# Altium project piezo-driver1.PrjPcb
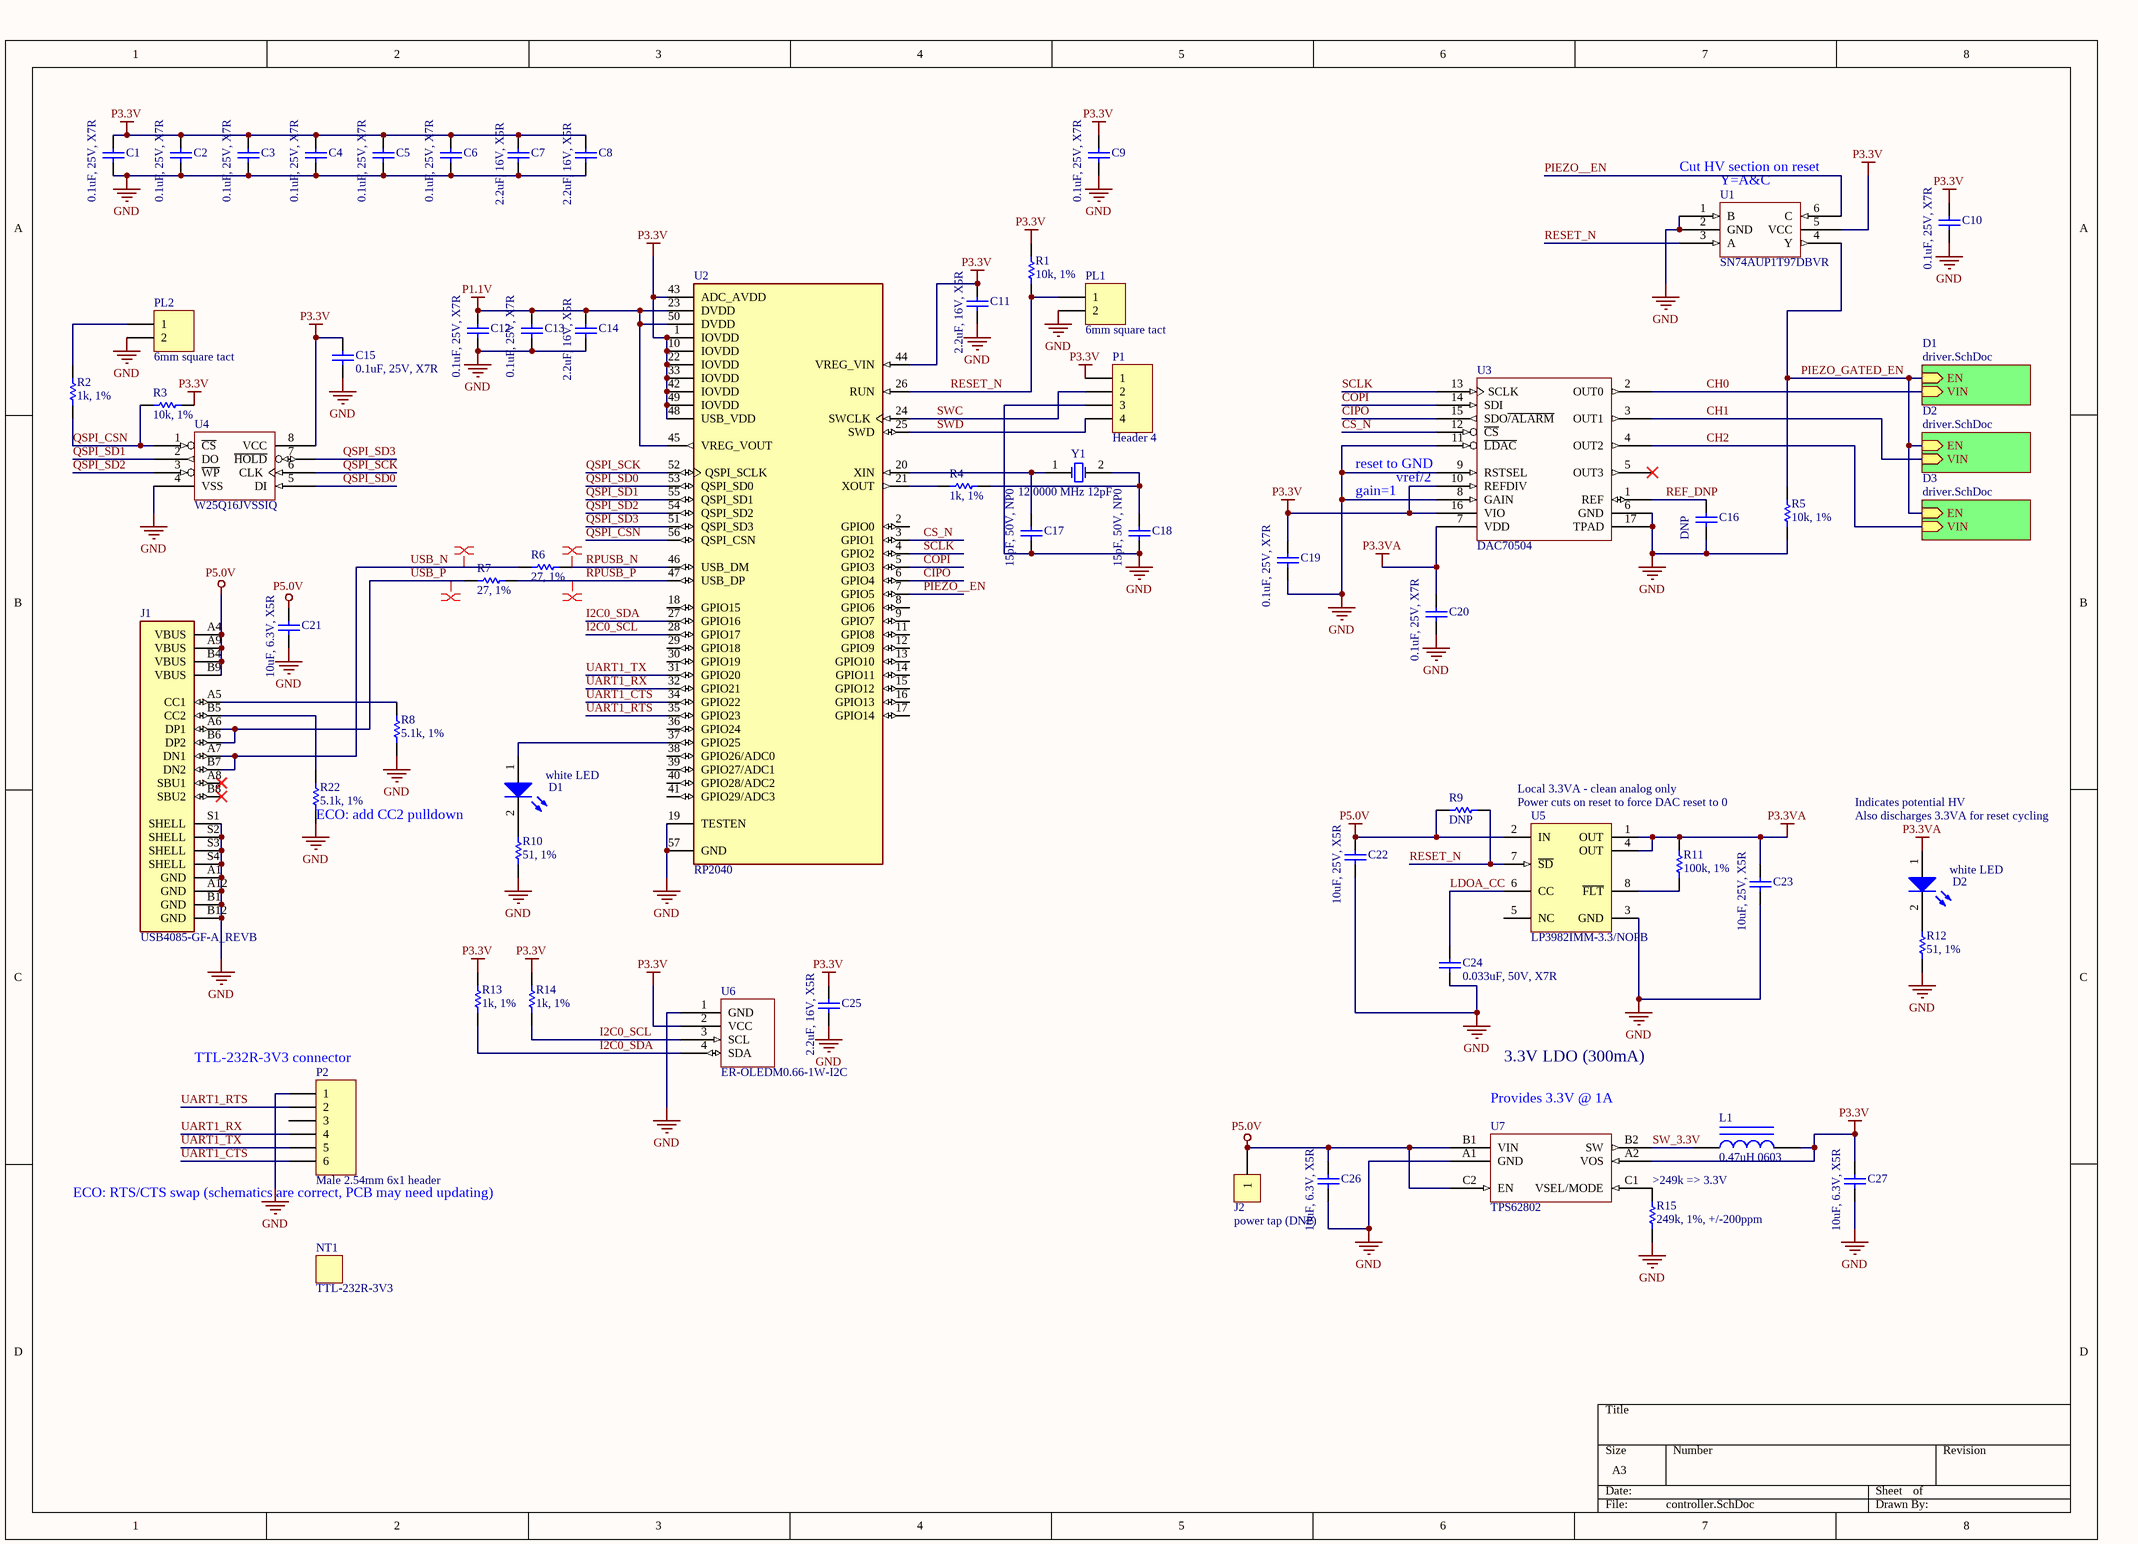
[diagram p0: controller.SchDoc]
2 sheets, 106 parts. Net scope: hierarchical (ports join the sheet entries above them; power ports are global).
Board file: piezo-driver1.PcbDoc
Sheets:
  controller.SchDoc
    D1 = driver.SchDoc
    D2 = driver.SchDoc
    D3 = driver.SchDoc

## Sheet controller.SchDoc
size A3; SheetNumber: 1; SheetTotal: 2

### Parts
C1  0.1uF, 25V, X7R  [B_CAP0603]
C2  0.1uF, 25V, X7R  [B_CAP0603]
C3  0.1uF, 25V, X7R  [B_CAP0603]
C4  0.1uF, 25V, X7R  [B_CAP0603]
C5  0.1uF, 25V, X7R  [B_CAP0603]
C6  0.1uF, 25V, X7R  [B_CAP0603]
C7  2.2uF, 16V, X5R  [B_CAP0603]
C8  2.2uF, 16V, X5R  [B_CAP0603]
C9  0.1uF, 25V, X7R  [B_CAP0603]
C10  0.1uF, 25V, X7R  [B_CAP0603]
C11  2.2uF, 16V, X5R  [B_CAP0603]
C12  0.1uF, 25V, X7R  [B_CAP0603]
C13  0.1uF, 25V, X7R  [B_CAP0603]
C14  2.2uF, 16V, X5R  [B_CAP0603]
C15  0.1uF, 25V, X7R  [B_CAP0603]
C16  DNP  [B_CAP0603]
C17  15pF, 50V, NP0  [B_CAP0603]
C18  15pF, 50V, NP0  [B_CAP0603]
C19  0.1uF, 25V, X7R  [B_CAP0603]
C20  0.1uF, 25V, X7R  [B_CAP0603]
C21  10uF, 6.3V, X5R  [B_CAP0603]
C22  10uF, 25V, X5R  [B_CAP0805]
C23  10uF, 25V, X5R  [B_CAP0805]
C24  0.033uF, 50V, X7R  [B_CAP0603]
C25  2.2uF, 16V, X5R  [B_CAP0603]
C26  10uF, 6.3V, X5R  [B_CAP0603]
C27  10uF, 6.3V, X5R  [B_CAP0603]
D1  white LED  [B_LED0805]
D2  white LED  [B_LED0805]
J1  USB4085-GF-A_REVB  [GCT_USB4085-GF-A_REVB]
J2  power tap (DNP)  [RESTAP-0603]
L1  0.47uH 0603  [B_IND0603]
NT1  TTL-232R-3V3
P1  Header 4  [HDR1X4]
P2  Male 2.54mm 6x1 header  [HDR1X6]
PL1  6mm square tact  [PANASONIC_EVPAS]
PL2  6mm square tact  [PANASONIC_EVPAS]
R1  10k, 1%  [B_RES0603]
R2  1k, 1%  [B_RES0603]
R3  10k, 1%  [B_RES0603]
R4  1k, 1%  [B_RES0603]
R5  10k, 1%  [B_RES0603]
R6  27, 1%  [B_RES0603]
R7  27, 1%  [B_RES0603]
R8  5.1k, 1%  [B_RES0603]
R9  DNP  [B_RES0603]
R10  51, 1%  [B_RES0603]
R11  100k, 1%  [B_RES0603]
R12  51, 1%  [B_RES0603]
R13  1k, 1%  [B_RES0603]
R14  1k, 1%  [B_RES0603]
R15  249k, 1%, +/-200ppm  [B_RES0402]
R22  5.1k, 1%  [B_RES0603]
U1  SN74AUP1T97DBVR  [SOT26A-6N]
U2  RP2040  [QFN40P700X700X90-57N]
U3  DAC70504  [QFN50P300X300X80_HS-17N]
U4  W25Q16JVSSIQ  [SOIC127P790X216-8N]
U5  LP3982IMM-3.3/NOPB  [MUA08A_N]
U6  ER-OLEDM0.66-1W-I2C  [ER-OLEDM0.66-1W-I2C]
U7  TPS62802  [BGA6C35P2X3_70X105X40_NSMD]
Y1  12.0000 MHz 12pF  [NDK_NX5032A]

### Sub-sheets
D1 = driver.SchDoc: EN (in), VIN (in)
D2 = driver.SchDoc: EN (in), VIN (in)
D3 = driver.SchDoc: EN (in), VIN (in)

### Nets
GND: C1.2 C2.2 C3.2 C4.2 C5.2 C6.2 C7.2 C8.2 C9.2 C10.2 C11.2 C12.2 C13.2 C14.2 C15.1 C16.2 C17.1 C18.1 C19.2 C20.2 C21.2 C22.2 C23.2 C24.1 C25.2 C26.2 C27.2 J1.A1(GND) J1.A12(GND) J1.B1(GND) J1.B12(GND) J1.S1(SHELL) J1.S2(SHELL) J1.S3(SHELL) J1.S4(SHELL) P1.3 P2.1 PL1.2 PL2.2 R5.2 R8.1 R10.1 R12.1 R15.2 R22.1 U1.1(B) U1.2(GND) U2.19(TESTEN) U2.57(GND) U3.6(GND) U3.8(GAIN) U3.9(RSTSEL) U3.11(~{LDAC}) U3.17(TPAD) U4.4(VSS) U5.3(GND) U6.1(GND) U7.A1(GND)
P1.1V: C12.1 C13.1 C14.1 U2.23(DVDD) U2.45(VREG_VOUT) U2.50(DVDD)
P3.3V: C1.1 C2.1 C3.1 C4.1 C5.1 C6.1 C7.1 C8.1 C9.1 C10.1 C11.1 C15.2 C19.1 C25.1 C27.1 L1.2 P1.1 R1.1 R3.2 R13.2 R14.2 U1.5(VCC) U2.1(IOVDD) U2.10(IOVDD) U2.22(IOVDD) U2.33(IOVDD) U2.42(IOVDD) U2.43(ADC_AVDD) U2.44(VREG_VIN) U2.48(USB_VDD) U2.49(IOVDD) U3.10(REFDIV) U3.16(VIO) U4.8(VCC) U6.2(VCC) U7.A2(VOS)
P3.3VA: C20.1 C23.1 D2.1(A) R11.2 U3.7(VDD) U5.1(OUT) U5.4(OUT)
P5.0V: C21.1 C22.1 C26.1 J1.A4(VBUS) J1.A9(VBUS) J1.B4(VBUS) J1.B9(VBUS) J2.1 R9.1 U5.2(IN) U7.B1(VIN) U7.C2(EN)
CH0: U3.2(OUT0) ; sheet D1/VIN
CH1: U3.3(OUT1) ; sheet D2/VIN
CH2: U3.4(OUT2) ; sheet D3/VIN
CIPO: U2.6(GPIO4) U3.15(SDO~{/ALARM})
COPI: U2.5(GPIO3) U3.14(SDI)
CS_N: U2.3(GPIO1) U3.12(~{CS})
I2C0_SCL: R14.1 U2.28(GPIO17) U6.3(SCL)
I2C0_SDA: R13.1 U2.27(GPIO16) U6.4(SDA)
LDOA_CC: C24.2 U5.6(CC)
PIEZO__EN: U1.6(C) U2.7(GPIO5)
PIEZO_GATED_EN: R5.1 U1.4(Y) ; sheet D1/EN, sheet D2/EN, sheet D3/EN
QSPI_CSN: R2.1 R3.1 U2.56(QSPI_CSN) U4.1(~{CS})
QSPI_SCK: U2.52(QSPI_SCLK) U4.6(CLK)
QSPI_SD0: U2.53(QSPI_SD0) U4.5(DI)
QSPI_SD1: U2.55(QSPI_SD1) U4.2(DO)
QSPI_SD2: U2.54(QSPI_SD2) U4.3(~{WP})
QSPI_SD3: U2.51(QSPI_SD3) U4.7(~{HOLD})
REF_DNP: C16.1 U3.1(REF)
RESET_N: PL1.1 R1.2 R9.2 U1.3(A) U2.26(RUN) U5.7(~{SD})
RPUSB_N: R6.2 U2.46(USB_DM)
RPUSB_P: R7.2 U2.47(USB_DP)
SCLK: U2.4(GPIO2) U3.13(SCLK)
SW_3.3V: L1.1 U7.B2(SW)
SWC: P1.2 U2.24(SWCLK)
SWD: P1.4 U2.25(SWD)
UART1_CTS: P2.6 U2.34(GPIO22)
UART1_RTS: P2.2 U2.35(GPIO23)
UART1_RX: P2.4 U2.32(GPIO21)
UART1_TX: P2.5 U2.31(GPIO20)
USB_N: J1.A7(DN1) J1.B7(DN2) R6.1
USB_P: J1.A6(DP1) J1.B6(DP2) R7.1
NetC17_2: C17.2 U2.20(XIN) Y1.1(OSC1)
NetC18_2: C18.2 R4.2 Y1.2(OSC2)
NetD1_1: D1.1(A) U2.37(GPIO25)
NetD1_2: D1.2(K) R10.2
NetD2_2: D2.2(K) R12.2
NetJ1_A5: J1.A5(CC1) R8.2
NetJ1_B5: J1.B5(CC2) R22.2
NetPL2_1: PL2.1 R2.2
NetR4_1: R4.1 U2.21(XOUT)
NetR11_1: R11.1 U5.8(~{FLT})
NetR15_1: R15.1 U7.C1(VSEL/MODE)

Not connected (* = marked no-connect by the designer): J1 A8(SBU1)* B8(SBU2)*; P2 3; U2 2(GPIO0) 8(GPIO6) 9(GPIO7) 11(GPIO8) 12(GPIO9) 13(GPIO10) 14(GPIO11) 15(GPIO12) 16(GPIO13) 17(GPIO14) 18(GPIO15) 29(GPIO18) 30(GPIO19) 36(GPIO24) 38(GPIO26/ADC0) 39(GPIO27/ADC1) 40(GPIO28/ADC2) 41(GPIO29/ADC3); U3 5(OUT3)*; U5 5(NC)

### Layout directives
differential pair: RPUSB_N, RPUSB_P, USB_N, USB_P

### Notes on the sheet
- (near U1) Cut HV section on reset
- (near U1) Y=A&C
- (near U3) reset to GND
- (near U3) vref/2
- gain=1
- (near R22) ECO: add CC2 pulldown
- Local 3.3VA - clean analog only
- Power cuts on reset to force DAC reset to 0
- Indicates potential HV
- Also discharges 3.3VA for reset cycling
- (near P2) TTL-232R-3V3 connector
- 3.3V LDO (300mA)
- (near U7) Provides 3.3V @ 1A
- (near P2) ECO: RTS/CTS swap (schematics are correct, PCB may need updating)
- (near R15) >249k => 3.3V

### Library data of the parts
C1-C6 C9 C10 C12 C13 C15 C19 C20 = Cap Semi: Capacitor (Semiconductor SIM Model); MPN: CC0603KRX7R8BB104; VENDOR: Murata; MYPN: C-104-25-X7R-0603
C7 C8 C11 C14 C25 = Cap Semi: Capacitor (Semiconductor SIM Model); MPN: CL10A225KO8NNNC; VENDOR: Samsung; MYPN: C-225-16-X5R-0603
C16 = Cap Semi: Capacitor (Semiconductor SIM Model); MPN: DNP; VENDOR: DNP; MYPN: DNP
C17 C18 = Cap Semi: Capacitor (Semiconductor SIM Model); MPN: CL10C150JB81PNC; VENDOR: Samsung; MYPN: C-150-50-NP0-0603
C21 C26 C27 = Cap Semi: Capacitor (Semiconductor SIM Model); MPN: CL10A106MQ8NNNC; VENDOR: Samsung; MYPN: C-106-6.3-X5R-0603
C22 C23 = Cap Semi: Capacitor (Semiconductor SIM Model); MPN: GRM21BR61E106KA73L; VENDOR: Murata; MYPN: C-106-25-X5R-0805
C24 = Cap Semi: Capacitor (Semiconductor SIM Model); MPN: CL10B333KB8NNNC; VENDOR: Samsung; MYPN: C-333-50-X7R-0603
D1 D2 = LED2: Typical RED, GREEN, YELLOW, AMBER GaAs LED; MPN: EAST2012WA1; VENDOR: Everlight; MYPN: D-LED-WHITE1-0805
J1 = USB4085-GF-A_REVB: USB-C (USB TYPE-C) USB 2.0 Receptacle Connector 24 (16+8 Dummy) Position Through Hole, Right Angle, low cost, 3.46mm profile, 16 pin, horizontal, Top mount; MF: Global Connector Technology; VENDOR: GCT; Package: None; Price: None; Value: *; SnapEDA_Link: https://www.snapeda.com/parts/USB4085-GF-A/Global+Connector+Technology/view-part/?ref=snap; MP: USB4085-GF-A; Availability: In Stock; Check_prices: https://www.snapeda.com/parts/USB4085-GF-A/Global+Connector+Technology/view-part/?ref=eda; MPN: USB4085-GF-A
J2 = CON1: Connector; MYPN: J-TP-PWRTAP-0603; MPN: DNP; VENDOR: DNP
L1 = Inductor Iron: Magnetic-Core Inductor; MPN: TFM160808ALC-R47MTAA; VENDOR: TDK; MYPN: L-TFM160808ALC-R47MTAA
NT1 = NOTE: Placeholder for non-board BOM items; MYPN: NT-USB-SERIAL-3.3V; VENDOR: FTDI; MPN: TTL-232R-3V3
P1 = Header 4: Header, 4-Pin; MPN: PH1-04-UA / ANY; VENDOR: Adam Tech / ANY; LatestRevisionDate: 17-Jul-2002; LatestRevisionNote: Re-released for DXP Platform.; Publisher: Altium Limited
P2 = Header 6: Header, 6-Pin; MPN: PH1-06-UA / ANY; VENDOR: Adam Tech / ANY; LatestRevisionDate: 17-Jul-2002; LatestRevisionNote: Re-released for DXP Platform.; Publisher: Altium Limited
PL1 PL2 = Header 2: Header, 2-Pin; MPN: EVP-ASAC1A; VENDOR: Panasonic; MYPN: SW-EVQ-P6DB35; LatestRevisionDate: 17-Jul-2002; LatestRevisionNote: Re-released for DXP Platform.; Publisher: Altium Limited
R1 R3 R5 = Res1: Resistor; MPN: RC0603FR-0710KL; VENDOR: Yageo; MYPN: R-103-1P-1_16W-0603
R2 R4 R13 R14 = Res1: Resistor; VENDOR: ANY; MYPN: R-102-1P-1_16W-0603; MPN: ANY
R6 R7 = Res1: Resistor; VENDOR: ANY; MYPN: R-270-1P-1_16W-0603; MPN: ANY
R8 R22 = Res1: Resistor; MPN: RC0603FR-075K1L; VENDOR: Yageo; MYPN: R-512-1P-1_16W-0603
R9 = Res1: Resistor; VENDOR: DNP; MYPN: DNP; MPN: DNP
R10 R12 = Res1: Resistor; VENDOR: ANY; MYPN: R-510-1P-1_16W-0603; MPN: ANY
R11 = Res1: Resistor; MPN: RC0603FR-07100KL; VENDOR: Yageo; MYPN: R-104-1P-1_16W-0603
R15 = Res1: Resistor; MPN: RC0402FR-07249KL; VENDOR: Yageo; MYPN: R-2493-1P-1_16W-0402
U1 = 74AUP1T97L6X: Low power configurable gate with voltage translator; MYPN: USN74AUP1T97DBVR; VENDOR: TI; MPN: SN74AUP1T97DBVR
U2 = RP2040: RP2040 chip for Raspberry Pi Pico - ARMÂ® CortexÂ®-M0+ MCU 32-Bit; MPN: SC0914(7/13); Check_prices: https://www.snapeda.com/parts/RP2040/Raspberry+Pi/view-part/?ref=eda; Value: *; Availability: In Stock; MP: RP2040; Price: None; Package: None; SnapEDA_Link: https://www.snapeda.com/parts/RP2040/Raspberry+Pi/view-part/?ref=snap; Purchase-URL: https://pricing.snapeda.com/search/part/RP2040/?ref=eda; MF: Raspberry Pi; VENDOR: Raspberry Pi
U3 = DACx0504: Quad SPI DAC with internal reference, in 16- (8), 14- (7), and 12-(6) bit variants; MPN: DAC70504RTET; VENDOR: TI
U4 = EN25P05-50GCP: 16Mbit SPI NOR FLASH; MYPN: UW25Q16JVSSIQ; VENDOR: Winbond; MPN: W25Q16JVSSIQ
U5 = LP3982IMM-3.3/NOPB: Micropower, Ultra Low-Dropout, Low-Noise, 300mA CMOS Regulator, 8-pin Mini SOIC, Pb-Free; Manufacturer: National Semiconductor; PackageTopMarking: ZXTT*LEUB; PowerWise: N; CompType: LDO IC; High-Reliability: Y; MYPN: ULP3982IMM-3.3/NOPB; VENDOR: TI; DatasheetVersion: Mar-2006; PackageVersion: revF, Apr-2008; PackageReference: MUA08A; PackageDescription: MINI SOIC, .118 x .118 x .034in, 8 Lead, .0256in Pitch; PartNumber: LP3982IMM-3.3/NOPB; RoHS: Y; PinCount: 8; Code_JEDEC: MO-187-AA; ComponentLink1Description: Manufacturer URL; ComponentLink1URL: http://www.national.com/; ComponentLink2Description: LP3982 Datasheet; ComponentLink2URL: http://www.national.com/ds/LP/LP3982.pdf; ComponentLink3Description: LP3982 Web Page; ComponentLink3URL: http://www.national.com/pf/LP/LP3982.html; ComponentLink4Description: MUA08A Package Page; ComponentLink4URL: http://www.national.com/packaging/folders/mua08a.html; MPN: LP3982IMM-3.3/NOPB
U6 = ER-OLEDM0.66-1W-I2C: 0.66" white OLED module, I2C; VENDOR: East Rising; MPN: ER-OLEDM0.66-1W-I2C
U7 = TPS62802: Buck regulator, 4MHz, 0.6A, 1.8V-3.3V, low Iq; MPN: TPS62802YKAR; VENDOR: TI; MYPN: U-TPS62802YKA(T/R)
Y1 = XTAL: Crystal Oscillator; MPN: ECS-120-12-30-JGN-TR; VENDOR: ECS; Published: 8-Jun-2000; LatestRevisionDate: 17-Jul-2002; LatestRevisionNote: Re-released for DXP Platform.; PackageReference: R38; Publisher: Altium Limited

## Sheet driver.SchDoc
size A3; SheetNumber: 2; SheetTotal: 2
Used 3 times, as channels D1, D2, D3. Parts and nets are listed once, with the designators drawn on the sheet.
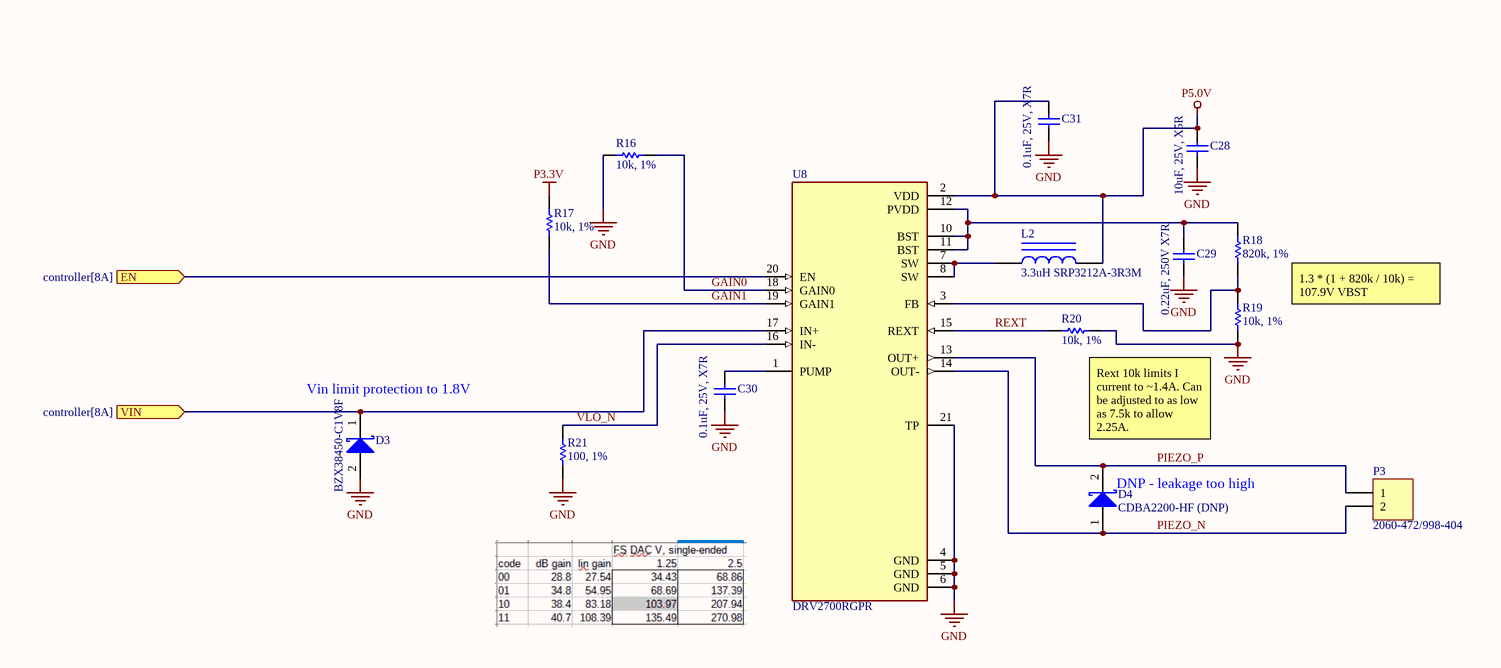
[diagram p1: driver.SchDoc]

### Parts
C28  10uF, 25V, X5R  [B_CAP0805]
C29  0.22uF, 250V X7R  [B_CAP1210]
C30  0.1uF, 25V, X7R  [B_CAP0603]
C31  0.1uF, 25V, X7R  [B_CAP0603]
D3  BZX38450-C1V8F  [SOD-323]
D4  CDBA2200-HF (DNP)  [DSO-C2/X1.8]
L2  3.3uH SRP3212A-3R3M  [B_IND1210_BOURNES]
P3  2060-472/998-404  [WAGO_2060-472/998-404]
R16  10k, 1%  [B_RES0603]
R17  10k, 1%  [B_RES0603]
R18  820k, 1%  [B_RES0603]
R19  10k, 1%  [B_RES0603]
R20  10k, 1%  [B_RES0603]
R21  100, 1%  [B_RES0603]
U8  DRV2700RGPR  [QFN50P400X400X100_HS-21N_DRV2700]

### Ports
EN (in, see controller[8A]), VIN (in, see controller[8A])

### Nets
GND: C28.2 C29.2 C30.2 C31.2 D3.2(A) R16.2 R19.1 R20.2 R21.2 U8.4(GND) U8.5(GND) U8.6(GND) U8.21(TP)
P3.3V: R17.1
P5.0V: C28.1 C31.1 L2.2 U8.2(VDD)
EN: U8.20(EN) ; port EN
GAIN0: R16.1 U8.18(GAIN0)
GAIN1: R17.2 U8.19(GAIN1)
PIEZO_N: D4.1(A) P3.2 U8.14(OUT-)
PIEZO_P: D4.2(K) P3.1 U8.13(OUT+)
REXT: R20.1 U8.15(REXT)
VIN: D3.1(K) U8.17(IN+) ; port VIN
VLO_N: R21.1 U8.16(IN-)
NetC29_1: C29.1 R18.2 U8.10(BST) U8.11(BST) U8.12(PVDD)
NetC30_1: C30.1 U8.1(PUMP)
NetL2_1: L2.1 U8.7(SW) U8.8(SW)
NetR18_1: R18.1 R19.2 U8.3(FB)

### Channels
D1: designators end in _D1; ports EN=PIEZO_GATED_EN VIN=CH0
D2: designators end in _D2; ports EN=PIEZO_GATED_EN VIN=CH1
D3: designators end in _D3; ports EN=PIEZO_GATED_EN VIN=CH2

### Notes on the sheet
- 1.3 * (1 + 820k / 10k) = 107.9V VBST
- (near D3) Vin limit protection to 1.8V
- Rext 10k limits I current to ~1.4A. Can be adjusted to as low as 7.5k to allow 2.25A.
- (near D4) DNP - leakage too high

### Library data of the parts
C28 = Cap Semi: as C22 on sheet controller
C29 = Cap Semi: Capacitor (Semiconductor SIM Model); MPN: GCJ32DR72E224KXJ1L; VENDOR: Murata; MYPN: C-224-250-X7R-1210
C30 C31 = Cap Semi: as C1 on sheet controller
D3 = D Schottky: Schottky Diode; VENDOR: Nexperia; MYPN: D-Z-1p8-SOD323; Revision: July-2002: Re-released for DXP Platform.; MPN: BZX38450-C1V8F
D4 = D Schottky: Schottky Diode; VENDOR: Comchip; MYPN: D-S-2-200-0p9-SMA; Revision: July-2002: Re-released for DXP Platform.; MPN: DNP
L2 = Inductor Iron: Magnetic-Core Inductor; VENDOR: Bournes; MYPN: L-SRP3212A-3R3M; MPN: SRP3212A-3R3M
P3 = Header 2: Header, 2-Pin; VENDOR: WAGO; MYPN: J-TB-2P-5.08; LatestRevisionDate: 17-Jul-2002; LatestRevisionNote: Re-released for DXP Platform.; Publisher: Altium Limited; MPN: 2060-472/998-404
R16 R17 R20 = Res1: as R1 on sheet controller
R18 = Res1: Resistor; MPN: RC0603FR-07820KL; VENDOR: Yageo; MYPN: R-820K-1P-1_10W-0603
R19 = Res1: Resistor; MPN: RC0603FR-0710KL; VENDOR: Yageo; MYPN: R-10K-1P-1_10W-0603
R21 = Res1: Resistor; VENDOR: ANY; MYPN: R-101-1P-1_16W-0603; MPN: ANY
U8 = DRV2700RGPR: Motor Driver Analog 20-QFN _4x4_; MPN: DRV2700RGP(T/R); MF: Texas Instruments; VENDOR: TI; SnapEDA_Link: https://www.snapeda.com/parts/DRV2700RGPR/Texas%20Instruments/view-part/1065208/?ref=snap; Availability: Unavailable; Value: *; Package: VFQFN-20 Texas Instruments; Price: None; MP: DRV2700RGPR

## Nets that join several sheets
GND: controller (58 pins), D1 (13 pins), D2 (13 pins), D3 (13 pins)
P3.3V: controller (36 pins), D1 (R17_D1.1), D2 (R17_D2.1), D3 (R17_D3.1)
P5.0V: controller (12 pins), D1 (C28_D1.1 C31_D1.1 L2_D1.2 U8_D1.2), D2 (C28_D2.1 C31_D2.1 L2_D2.2 U8_D2.2), D3 (C28_D3.1 C31_D3.1 L2_D3.2 U8_D3.2)
CH0: controller (U3.2), D1 (D3_D1.1 U8_D1.17)
CH1: controller (U3.3), D2 (D3_D2.1 U8_D2.17)
CH2: controller (U3.4), D3 (D3_D3.1 U8_D3.17)
PIEZO_GATED_EN: controller (R5.1 U1.4), D1 (U8_D1.20), D2 (U8_D2.20), D3 (U8_D3.20)